# Altium project DM1097_R1M1E1.PrjPcb (part 1 of 12)
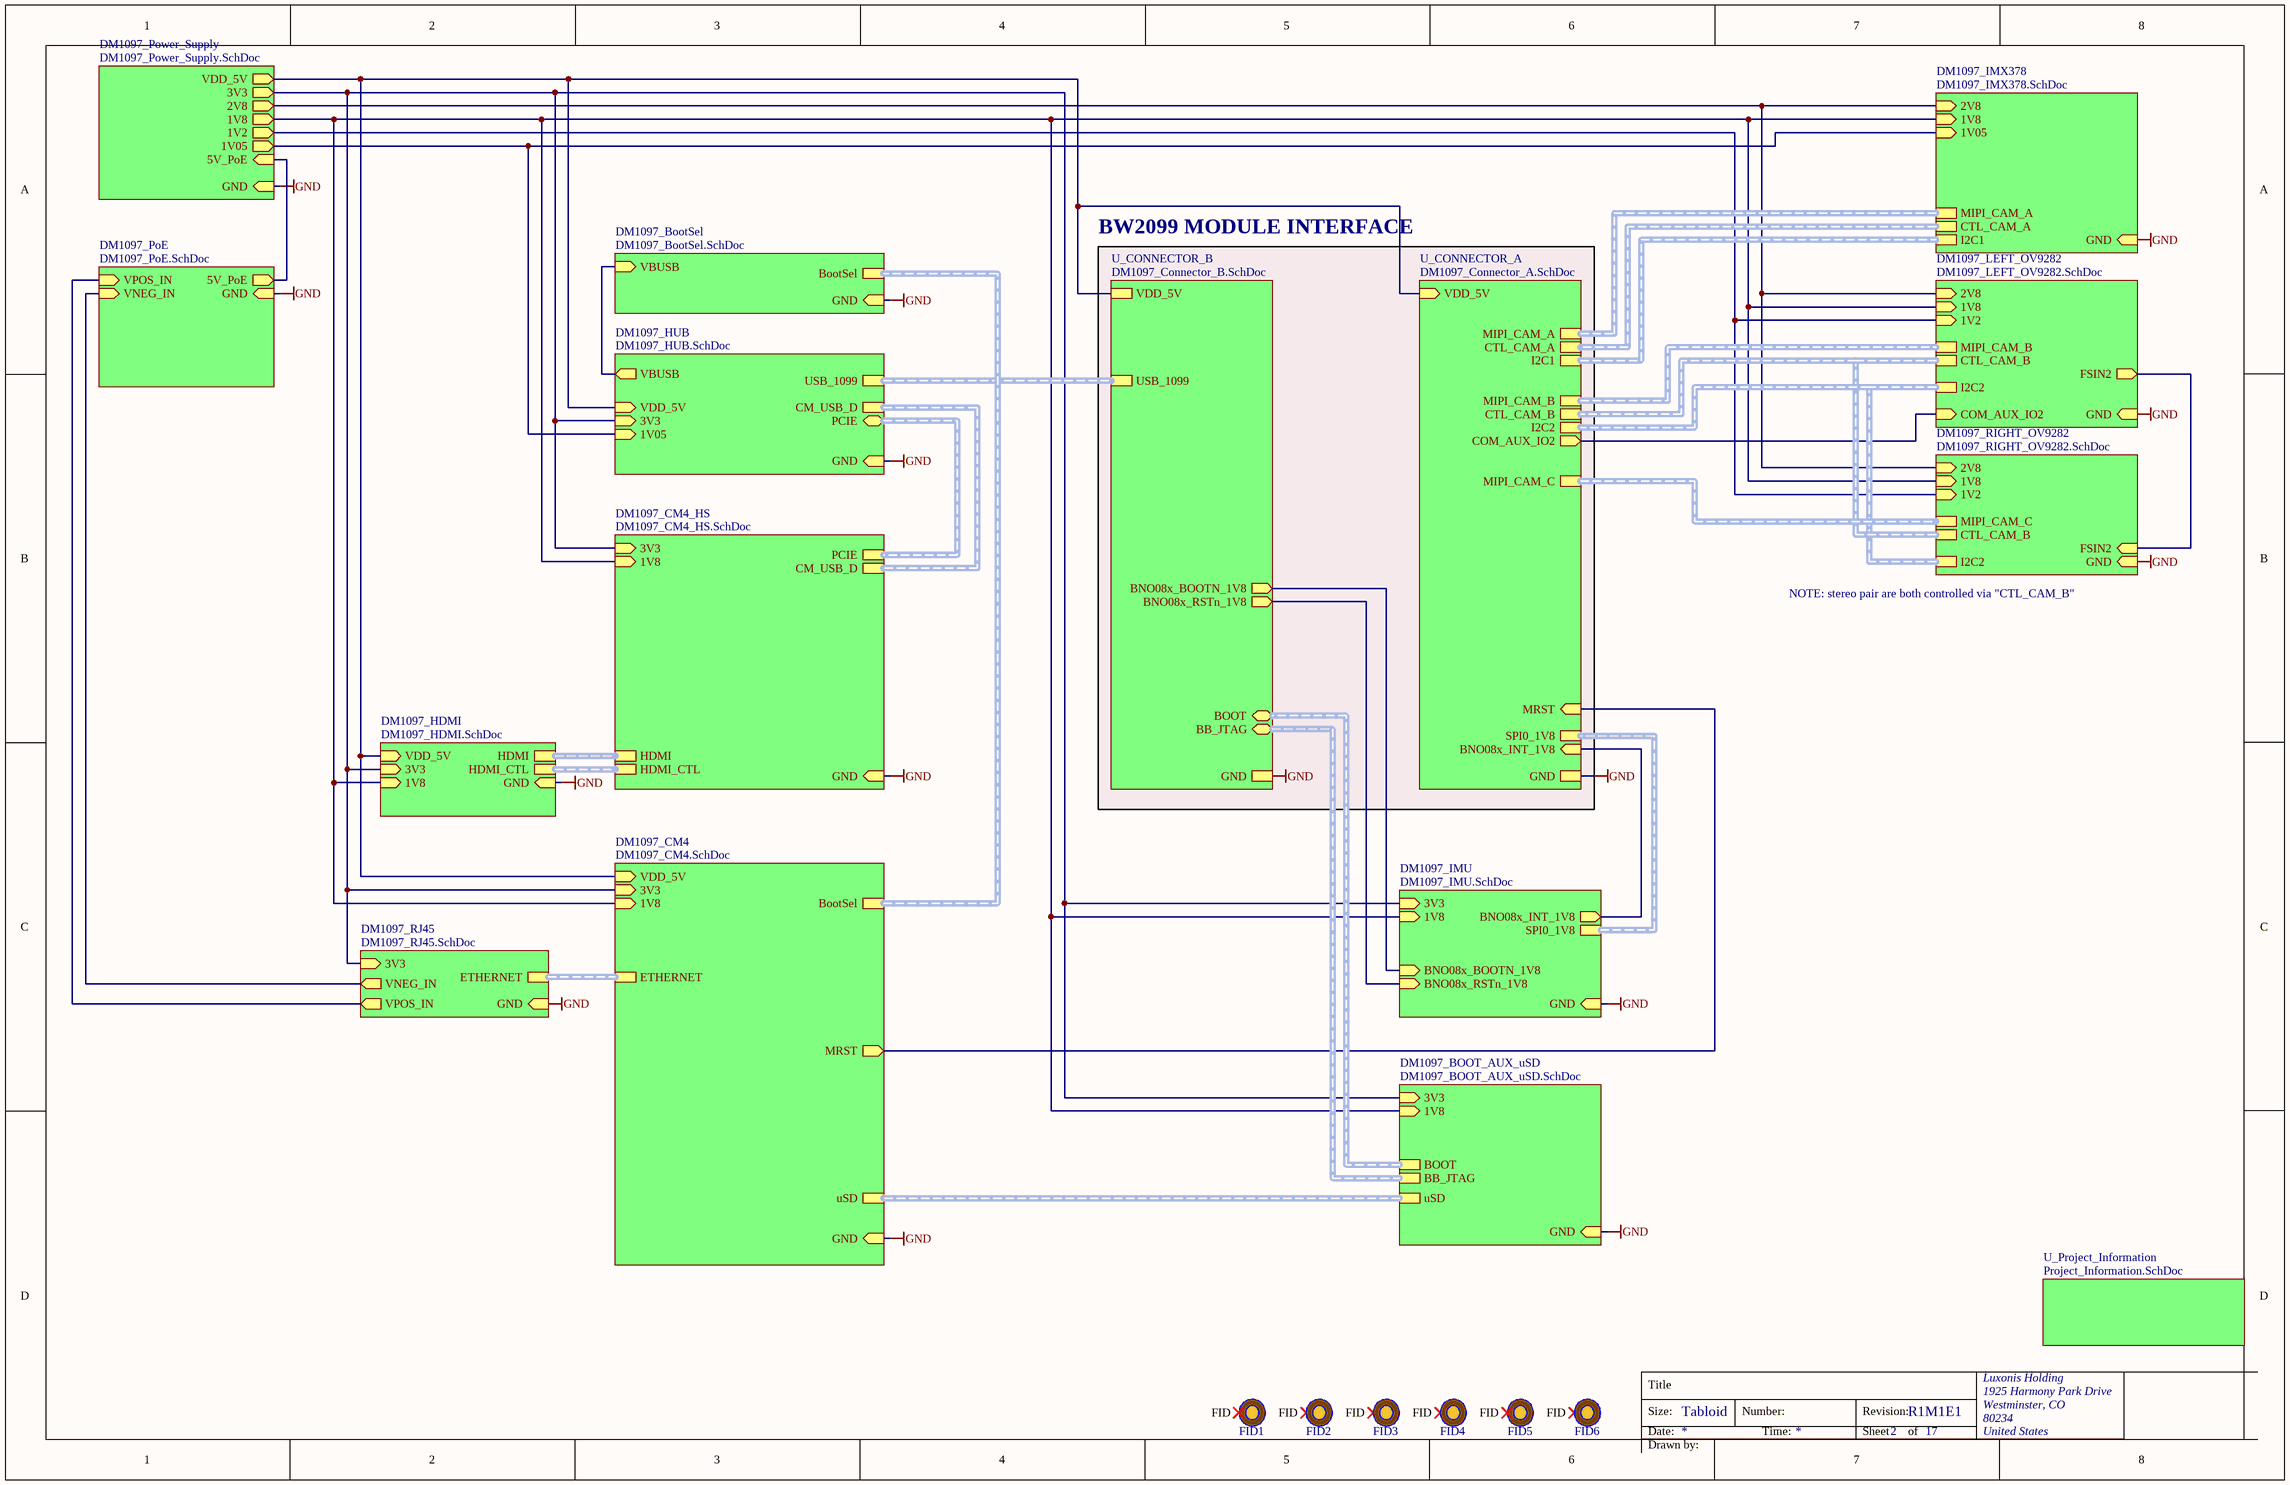
[diagram p0: DM1097_TopLevel.SchDoc]
document_number: D0000200; drawn_by: David Malovrh; project_title: DM1097; revision: R1M1E1
17 sheets, 379 parts. Net scope: strictly hierarchical (ports join the sheet entries above them; power ports are local).
Board file: DM1097_R1M1E1.PcbDoc
Sheets:
  DM1097_TopLevel.SchDoc
    DM1097_IMX378 = DM1097_IMX378.SchDoc
    DM1097_CM4 = DM1097_CM4.SchDoc
    DM1097_BOOT_AUX_uSD = DM1097_BOOT_AUX_uSD.SchDoc
    DM1097_BootSel = DM1097_BootSel.SchDoc
    DM1097_HUB = DM1097_HUB.SchDoc
    DM1097_RJ45 = DM1097_RJ45.SchDoc
    DM1097_RIGHT_OV9282 = DM1097_RIGHT_OV9282.SchDoc
    DM1097_LEFT_OV9282 = DM1097_LEFT_OV9282.SchDoc
    DM1097_Power_Supply = DM1097_Power_Supply.SchDoc
    DM1097_HDMI = DM1097_HDMI.SchDoc
    U_Project_Information = Project_Information.SchDoc
    DM1097_CM4_HS = DM1097_CM4_HS.SchDoc
    DM1097_PoE = DM1097_PoE.SchDoc
    U_CONNECTOR_B = DM1097_Connector_B.SchDoc
    U_CONNECTOR_A = DM1097_Connector_A.SchDoc
    DM1097_IMU = DM1097_IMU.SchDoc

## Sheet DM1097_TopLevel.SchDoc: =project_title
size Tabloid; PageSetup: Record=PageOptions|CenterHorizontal=True|CenterVertical=True|PrintScale=0.73|XCorrection=1.00|YCorrection=1.00|PrintKind=0|BorderSize=5000000|LeftOffset=0|BottomOffset=0|Orientation=2|PaperLength=1000|PaperWidth=1000|Scale=100|PaperSource=7|PrintQuality=-4|MediaType=1|DitherType=10|PaperKind=A4|PrintScaleMode=1; CompanyName: Luxonis Holding; DrawnBy: David Malovrh; Organization: Luxonis Holding; Address1: 1925 Harmony Park Drive; Address2: Westminster, CO; Address3: 80234; Address4: United States; DocumentNumber: D0000200; Revision: R1M1E1; SheetNumber: 2; SheetTotal: 17

### Parts
FID1  FIDUCIAL_ROUND_1MM  [FIDUCIAL_ROUND_1MM]  (value not drawn)  (no BOM)
FID2  FIDUCIAL_ROUND_1MM  [FIDUCIAL_ROUND_1MM]  (value not drawn)  (no BOM)
FID3  FIDUCIAL_ROUND_1MM  [FIDUCIAL_ROUND_1MM]  (value not drawn)  (no BOM)
FID4  FIDUCIAL_ROUND_1MM  [FIDUCIAL_ROUND_1MM]  (value not drawn)  (no BOM)
FID5  FIDUCIAL_ROUND_1MM  [FIDUCIAL_ROUND_1MM]  (value not drawn)  (no BOM)
FID6  FIDUCIAL_ROUND_1MM  [FIDUCIAL_ROUND_1MM]  (value not drawn)  (no BOM)

### Sub-sheets
DM1097_BOOT_AUX_uSD = DM1097_BOOT_AUX_uSD.SchDoc: uSD (harness uSD), 3V3 (in), GND (in), BB_JTAG (harness uSD), BOOT (harness uSD), 1V8 (in)
DM1097_BootSel = DM1097_BootSel.SchDoc: VBUSB (in), BootSel (harness BootSel), GND (in)
DM1097_CM4 = DM1097_CM4.SchDoc: GND (in), 3V3 (in), VDD_5V (in), BootSel (harness BootSel), ETHERNET (harness ETHERNET), 1V8 (in), MRST (out), uSD
DM1097_CM4_HS = DM1097_CM4_HS.SchDoc: HDMI (harness HDMI), HDMI_CTL (harness HDMI_CTL), GND (in), CM_USB_D, PCIE (harness PCIE), 3V3 (in), 1V8 (in)
DM1097_HDMI = DM1097_HDMI.SchDoc: HDMI_CTL (harness HDMI_CTL), HDMI (harness HDMI), 3V3 (in), GND (in), VDD_5V (in), 1V8 (in)
DM1097_HUB = DM1097_HUB.SchDoc: CM_USB_D (harness CM _USB_D), USB_1099 (harness USB_M), VDD_5V (in), 3V3 (in), GND (in), VBUSB (out), PCIE (bidir, harness Harness), 1V05 (in)
DM1097_IMU = DM1097_IMU.SchDoc: 3V3 (in), GND (in), SPI0_1V8 (harness uSD), BNO08x_INT_1V8 (out), BNO08x_BOOTN_1V8 (in), BNO08x_RSTn_1V8 (in), 1V8 (in)
DM1097_IMX378 = DM1097_IMX378.SchDoc: 2V8 (in), 1V05 (in), I2C1 (harness I2C1), MIPI_CAM_A (harness MIPI_CAM_A), CTL_CAM_A (harness CTL_CAM_A), GND (in), 1V8 (in)
DM1097_LEFT_OV9282 = DM1097_LEFT_OV9282.SchDoc: I2C2 (harness I2C2), CTL_CAM_B (harness CTL_CAM_B), MIPI_CAM_B (harness MIPI_CAM_B), 1V2 (in), 2V8 (in), GND (in), 1V8 (in), FSIN2 (out), COM_AUX_IO2 (in)
DM1097_PoE = DM1097_PoE.SchDoc: VNEG_IN (in), VPOS_IN (in), 5V_PoE (out), GND (in)
DM1097_Power_Supply = DM1097_Power_Supply.SchDoc: 1V8 (out), 2V8 (out), 1V05 (out), VDD_5V (out), GND (in), 3V3 (out), 1V2 (out), 5V_PoE (in)
DM1097_RIGHT_OV9282 = DM1097_RIGHT_OV9282.SchDoc: I2C2 (harness I2C2), 1V2 (in), 2V8 (in), GND (in), 1V8 (in), FSIN2 (in), MIPI_CAM_C (harness MIPI_CAM_C), CTL_CAM_B (harness CTL_CAM_B)
DM1097_RJ45 = DM1097_RJ45.SchDoc: 3V3 (in), ETHERNET (harness ETHERNET), GND (in), VNEG_IN (out), VPOS_IN (out)
U_CONNECTOR_A = DM1097_Connector_A.SchDoc: I2C2 (harness I2C2), I2C1 (harness I2C1), MIPI_CAM_C (harness MIPI_CAM_C), CTL_CAM_A (harness CTL_CAM_A), MIPI_CAM_A (harness MIPI_CAM_A), MIPI_CAM_B (harness MIPI_CAM_B), GND, CTL_CAM_B (harness CTL_CAM_B), COM_AUX_IO2 (out), MRST (in), BNO08x_INT_1V8 (in), SPI0_1V8, VDD_5V (in)
U_CONNECTOR_B = DM1097_Connector_B.SchDoc: VDD_5V, GND, BOOT (bidir, harness BOOT), BB_JTAG (bidir, harness BB_JTAG), USB_1099, BNO08x_BOOTN_1V8 (out), BNO08x_RSTn_1V8 (out)
U_Project_Information = Project_Information.SchDoc: no entries

### Nets
1V2: sheet DM1097_RIGHT_OV9282/1V2, sheet DM1097_LEFT_OV9282/1V2, sheet DM1097_Power_Supply/1V2
1V05: sheet DM1097_IMX378/1V05, sheet DM1097_HUB/1V05, sheet DM1097_Power_Supply/1V05
1V8: sheet DM1097_IMX378/1V8, sheet DM1097_CM4/1V8, sheet DM1097_BOOT_AUX_uSD/1V8, sheet DM1097_RIGHT_OV9282/1V8, sheet DM1097_LEFT_OV9282/1V8, sheet DM1097_Power_Supply/1V8, sheet DM1097_HDMI/1V8, sheet DM1097_CM4_HS/1V8, sheet DM1097_IMU/1V8
2V8: sheet DM1097_IMX378/2V8, sheet DM1097_RIGHT_OV9282/2V8, sheet DM1097_LEFT_OV9282/2V8, sheet DM1097_Power_Supply/2V8
3V3: sheet DM1097_CM4/3V3, sheet DM1097_BOOT_AUX_uSD/3V3, sheet DM1097_HUB/3V3, sheet DM1097_RJ45/3V3, sheet DM1097_Power_Supply/3V3, sheet DM1097_HDMI/3V3, sheet DM1097_CM4_HS/3V3, sheet DM1097_IMU/3V3
5V_PoE: sheet DM1097_Power_Supply/5V_PoE, sheet DM1097_PoE/5V_PoE
GND: sheet DM1097_IMX378/GND, sheet DM1097_CM4/GND, sheet DM1097_BOOT_AUX_uSD/GND, sheet DM1097_BootSel/GND, sheet DM1097_HUB/GND, sheet DM1097_RJ45/GND, sheet DM1097_RIGHT_OV9282/GND, sheet DM1097_LEFT_OV9282/GND, sheet DM1097_Power_Supply/GND, sheet DM1097_HDMI/GND, sheet DM1097_CM4_HS/GND, sheet DM1097_PoE/GND, sheet U_CONNECTOR_B/GND, sheet U_CONNECTOR_A/GND, sheet DM1097_IMU/GND
VBUSB: sheet DM1097_BootSel/VBUSB, sheet DM1097_HUB/VBUSB
VDD_5V: sheet DM1097_CM4/VDD_5V, sheet DM1097_HUB/VDD_5V, sheet DM1097_Power_Supply/VDD_5V, sheet DM1097_HDMI/VDD_5V, sheet U_CONNECTOR_B/VDD_5V, sheet U_CONNECTOR_A/VDD_5V
VNEG_IN: sheet DM1097_RJ45/VNEG_IN, sheet DM1097_PoE/VNEG_IN
AUX_IO_IRQ: sheet U_CONNECTOR_A/BNO08x_INT_1V8, sheet DM1097_IMU/BNO08x_INT_1V8
BNO08x_RSTn_1V8: sheet U_CONNECTOR_B/BNO08x_RSTn_1V8, sheet DM1097_IMU/BNO08x_RSTn_1V8
COM_AUX_IO2: sheet DM1097_LEFT_OV9282/COM_AUX_IO2, sheet U_CONNECTOR_A/COM_AUX_IO2
FSIN2: sheet DM1097_RIGHT_OV9282/FSIN2, sheet DM1097_LEFT_OV9282/FSIN2
GPIO1/MRST: sheet DM1097_CM4/MRST, sheet U_CONNECTOR_A/MRST
VPOS_IN: sheet DM1097_RJ45/VPOS_IN, sheet DM1097_PoE/VPOS_IN
NetJ21_42: sheet U_CONNECTOR_B/BNO08x_BOOTN_1V8, sheet DM1097_IMU/BNO08x_BOOTN_1V8

Not connected (* = marked no-connect by the designer): FID1 FID*; FID2 FID*; FID3 FID*; FID4 FID*; FID5 FID*; FID6 FID*

### Buses and harness runs
harness sheet DM1097_BOOT_AUX_uSD/BB_JTAG = sheet U_CONNECTOR_B/BB_JTAG
harness sheet DM1097_BOOT_AUX_uSD/BOOT = sheet U_CONNECTOR_B/BOOT
harness sheet DM1097_BOOT_AUX_uSD/uSD = sheet DM1097_CM4/uSD
harness sheet DM1097_BootSel/BootSel = sheet DM1097_CM4/BootSel
harness sheet DM1097_CM4/ETHERNET = sheet DM1097_RJ45/ETHERNET
harness sheet DM1097_CM4_HS/CM_USB_D = sheet DM1097_HUB/CM_USB_D
harness sheet DM1097_CM4_HS/HDMI = sheet DM1097_HDMI/HDMI
harness sheet DM1097_CM4_HS/HDMI_CTL = sheet DM1097_HDMI/HDMI_CTL
harness sheet DM1097_CM4_HS/PCIE = sheet DM1097_HUB/PCIE
harness sheet DM1097_HUB/USB_1099 = sheet U_CONNECTOR_B/USB_1099
harness sheet DM1097_IMU/SPI0_1V8 = sheet U_CONNECTOR_A/SPI0_1V8
harness sheet DM1097_IMX378/CTL_CAM_A = sheet U_CONNECTOR_A/CTL_CAM_A
harness sheet DM1097_IMX378/I2C1 = sheet U_CONNECTOR_A/I2C1
harness sheet DM1097_IMX378/MIPI_CAM_A = sheet U_CONNECTOR_A/MIPI_CAM_A
harness sheet DM1097_LEFT_OV9282/CTL_CAM_B = sheet DM1097_RIGHT_OV9282/CTL_CAM_B = sheet U_CONNECTOR_A/CTL_CAM_B
harness sheet DM1097_LEFT_OV9282/I2C2 = sheet DM1097_RIGHT_OV9282/I2C2 = sheet U_CONNECTOR_A/I2C2
harness sheet DM1097_LEFT_OV9282/MIPI_CAM_B = sheet U_CONNECTOR_A/MIPI_CAM_B
harness sheet DM1097_RIGHT_OV9282/MIPI_CAM_C = sheet U_CONNECTOR_A/MIPI_CAM_C

### Notes on the sheet
- BW2099 MODULE INTERFACE
- NOTE: stereo pair are both controlled via "CTL_CAM_B"
- Title
- Size:
- Date:
- Tabloid
- Number:
- Time:
- Revision:
- Sheet
- of
- Drawn by:

### Library data of the parts
FID1-FID6 = FIDUCIAL: Fiducial with various available footprints

## Sheet DM1097_IMX378.SchDoc: =project_title
size Tabloid; PageSetup: Record=PageOptions|CenterHorizontal=True|CenterVertical=True|PrintScale=0.71|XCorrection=1.00|YCorrection=1.00|PrintKind=0|BorderSize=5000000|LeftOffset=0|BottomOffset=0|Orientation=2|PaperLength=1000|PaperWidth=1000|Scale=100|PaperSource=7|PrintQuality=-4|MediaType=1|DitherType=10|PrintScaleMode=1|PaperKind=A4; CompanyName: Luxonis Holding; DrawnBy: David Malovrh; Organization: Luxonis Holding; Address1: 1925 Harmony Park Drive; Address2: Westminster, CO; Address3: 80234; Address4: United States; DocumentNumber: D0000200; Revision: R1M1E1; SheetNumber: 4; SheetTotal: 17
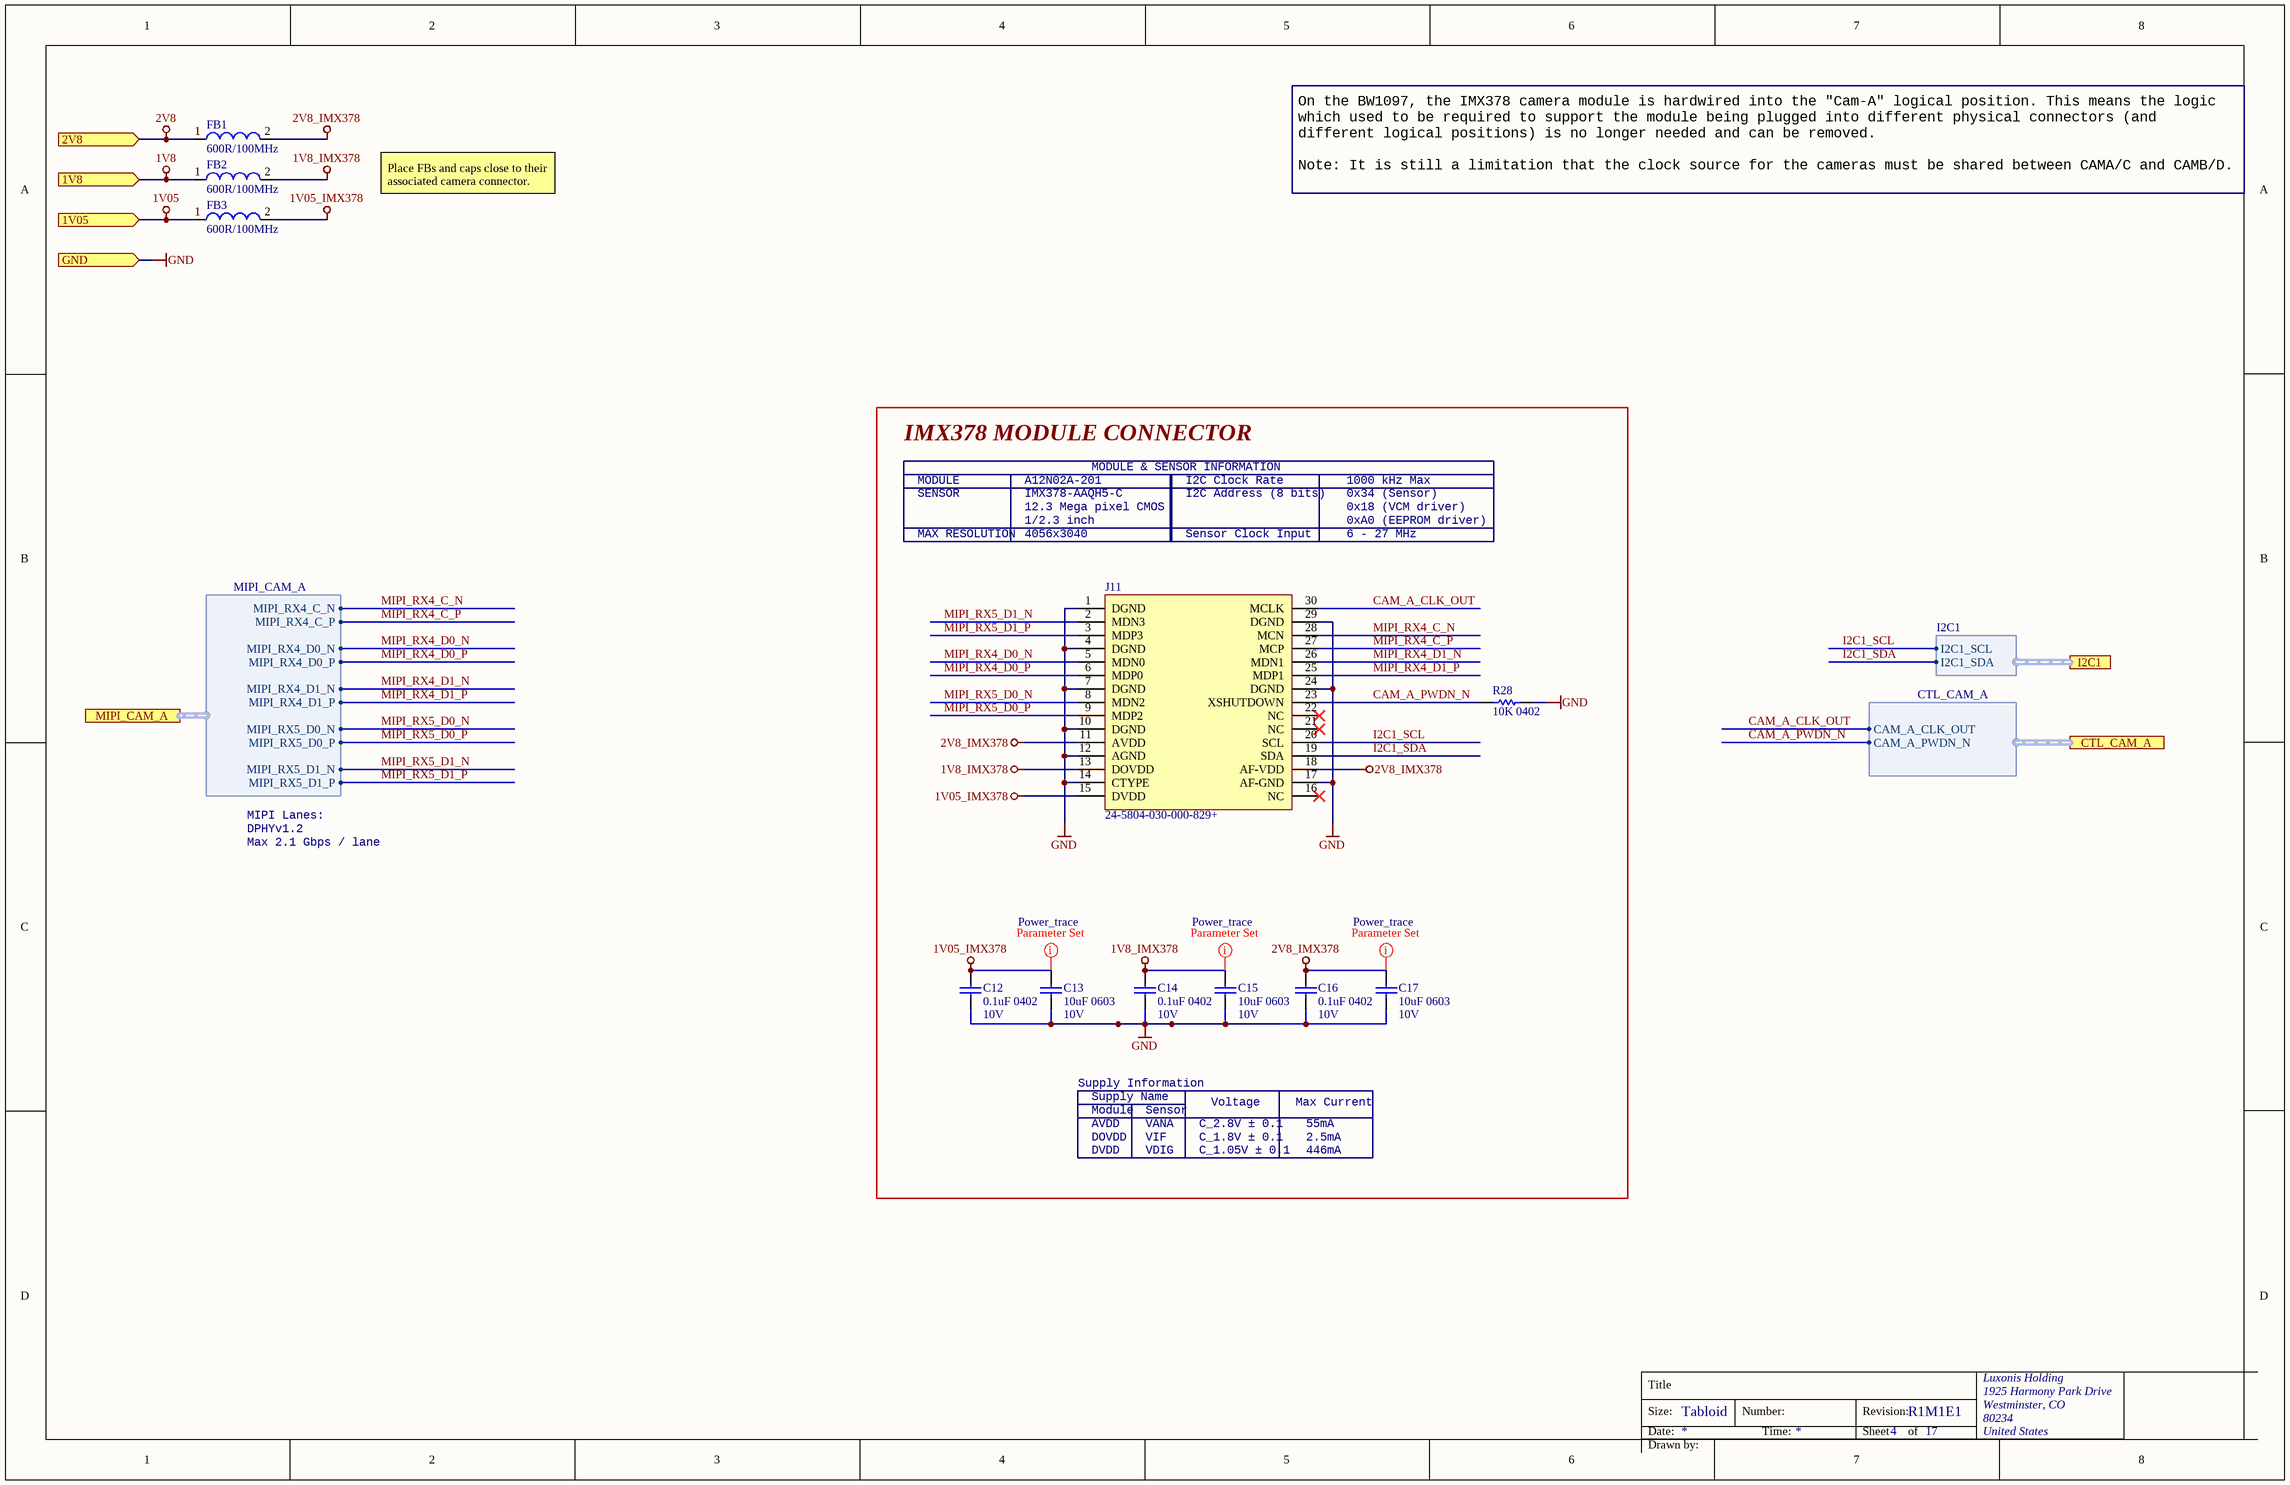
[diagram p1: DM1097_IMX378.SchDoc]

### Parts
C12  0.1uF 0402  Voltage Rating: 10V  [CAPC0402(1005)70_N]
C13  10uF 0603  Voltage Rating: 10V  [CAPC0603(1608)100_N]
C14  0.1uF 0402  Voltage Rating: 10V  [CAPC0402(1005)70_N]
C15  10uF 0603  Voltage Rating: 10V  [CAPC0603(1608)100_N]
C16  0.1uF 0402  Voltage Rating: 10V  [CAPC0402(1005)70_N]
C17  10uF 0603  Voltage Rating: 10V  [CAPC0603(1608)100_N]
FB1  600R/100MHz  [2508056017Y2]
FB2  600R/100MHz  [2508056017Y2]
FB3  600R/100MHz  [2508056017Y2]
J11  24-5804-030-000-829+  [A12N02A-201_1.6mmbrd_MatedModule]
R28  10K 0402  [RESC0402(1005)_N]

### Blocks framed on the sheet
IMX378 MODULE CONNECTOR: C12-C17 J11 R28

### Ports
1V05 (in), 1V8 (in), 2V8 (in), CTL_CAM_A (harness CTL_CAM_A), GND (in), I2C1 (harness I2C1), MIPI_CAM_A (harness MIPI_CAM_A)

### Harnesses
I2C1: I2C1_SDA, I2C1_SCL
MIPI_CAM_A: MIPI_RX4_C_P, MIPI_RX4_C_N, MIPI_RX4_D0_P, MIPI_RX4_D0_N, MIPI_RX4_D1_P, MIPI_RX4_D1_N, MIPI_RX5_D0_P, MIPI_RX5_D0_N, MIPI_RX5_D1_P, MIPI_RX5_D1_N
CTL_CAM_A: CAM_A_PWDN_N, CAM_A_CLK_OUT

### Nets
1V05: FB3.1 ; port 1V05
1V05_IMX378: C12.2 C13.2 FB3.2 J11.15(DVDD)
1V8: FB2.1 ; port 1V8
1V8_IMX378: C14.2 C15.2 FB2.2 J11.13(DOVDD)
2V8: FB1.1 ; port 2V8
2V8_IMX378: C16.2 C17.2 FB1.2 J11.11(AVDD) J11.18(AF-VDD)
GND: C12.1 C13.1 C14.1 C15.1 C16.1 C17.1 J11.1(DGND) J11.4(DGND) J11.7(DGND) J11.10(DGND) J11.12(AGND) J11.14(CTYPE) J11.17(AF-GND) J11.24(DGND) J11.29(DGND) R28.2 ; port GND
CAM_A_CLK_OUT: J11.30(MCLK) ; port CTL_CAM_A.CAM_A_CLK_OUT
CAM_A_PWDN_N: J11.23(XSHUTDOWN) R28.1 ; port CTL_CAM_A.CAM_A_PWDN_N
I2C1_SCL: J11.20(SCL) ; port I2C1.I2C1_SCL
I2C1_SDA: J11.19(SDA) ; port I2C1.I2C1_SDA
MIPI_RX4_C_N: J11.28(MCN) ; port MIPI_CAM_A.MIPI_RX4_C_N
MIPI_RX4_C_P: J11.27(MCP) ; port MIPI_CAM_A.MIPI_RX4_C_P
MIPI_RX4_D0_N: J11.5(MDN0) ; port MIPI_CAM_A.MIPI_RX4_D0_N
MIPI_RX4_D0_P: J11.6(MDP0) ; port MIPI_CAM_A.MIPI_RX4_D0_P
MIPI_RX4_D1_N: J11.26(MDN1) ; port MIPI_CAM_A.MIPI_RX4_D1_N
MIPI_RX4_D1_P: J11.25(MDP1) ; port MIPI_CAM_A.MIPI_RX4_D1_P
MIPI_RX5_D0_N: J11.8(MDN2) ; port MIPI_CAM_A.MIPI_RX5_D0_N
MIPI_RX5_D0_P: J11.9(MDP2) ; port MIPI_CAM_A.MIPI_RX5_D0_P
MIPI_RX5_D1_N: J11.2(MDN3) ; port MIPI_CAM_A.MIPI_RX5_D1_N
MIPI_RX5_D1_P: J11.3(MDP3) ; port MIPI_CAM_A.MIPI_RX5_D1_P

Not connected (* = marked no-connect by the designer): J11 16(NC)* 21(NC)* 22(NC)*

### Layout directives
net class Power_trace: 1V05_IMX378, 1V8_IMX378, 2V8_IMX378

### Notes on the sheet
- Place FBs and caps close to their associated camera connector.
- On the BW1097, the IMX378 camera module is hardwired into the "Cam-A" logical position. This means the logic which used to be required to support the module being plugged into different physical connectors (and different logical positions) is no longer needed and can be removed.
  Note: It is still a limitation that the clock source for the cameras must be shared between CAMA/C and CAMB/D.
- SENSOR
- MODULE
- IMX378-AAQH5-C
- A12N02A-201
- MODULE & SENSOR INFORMATION
- I2C Address (8 bits)
- I2C Clock Rate
- 0x34 (Sensor)
- 1000 kHz Max
- MAX RESOLUTION
- 12.3 Mega pixel CMOS
- 4056x3040
- 1/2.3 inch
- Sensor Clock Input
- 0x18 (VCM driver)
- 0xA0 (EEPROM driver)
- 6 - 27 MHz
- MIPI Lanes:
- DPHYv1.2
- Max 2.1 Gbps / lane
- Supply Information
- Supply Name
- Voltage
- Max Current
- AVDD
- DOVDD
- DVDD
- Module
- VANA
- VIF
- VDIG
- Sensor
- C_2.8V ± 0.1
- C_1.8V ± 0.1
- C_1.05V ± 0.1
- 55mA
- 2.5mA
- 446mA
- Title
- Size:
- Date:
- Tabloid
- Number:
- Time:
- Revision:
- Sheet
- of
- Drawn by:

### Library data of the parts
C12 C14 C16 = GRM155R71A104JA01D: CAP CER 0.1UF 10V X7R 0402 5%; Manufacturer 1: Murata; Capacitance: 100nF; Manufacturer Part Number 1: GRM155R71A104JA01D; Supplier 1: Digi-Key; Stock 1: 1346709; Pricing 1: 1=0.10000, 10=0.02500, 100=0.01130, 500=0.00806, 1000=0.00633, 2500=0.00575, 5000=0.00529 (USD); RoHS: Yes; Mount: Surface Mount; Case/Package: 0402; Case Code (Imperial): 0402; Case Code (Metric): 1005; Min Operating Temperature: -55°C; Max Operating Temperature: 125°C; Tolerance: 5%; Packaging: Tape and Reel; Voltage Rating (DC): 10V; Dielectric: X7R; Package Quantity: 10000; Termination: SMD/SMT; Length: 1mm; Height: 0.5mm; Width: 0.02inch; Thickness: 0.022inch; Depth: 0.5mm; Radiation Hardening: No; Lead Free: Lead Free; ComponentLink1URL: https://datasheet.ciiva.com/5411/product-5411135.pdf?src-supplier=Mouser; ComponentLink1Description: https://datasheet.ciiva.com/5411/product-5411135.pdf?src-supplier=Mouser; ComponentLink2URL: https://datasheet.ciiva.com/11618/c02e-11618821.pdf?src-supplier=Avnet; ComponentLink2Description: https://datasheet.ciiva.com/11618/c02e-11618821.pdf?src-supplier=Avnet; Supplier Part Number 1: 490-10777-1-ND
C13 C15 C17 = GRM188R61A106ME69D: CAP CER 10UF 10V X5R 0603 20%; Manufacturer 1: Murata; Material: Ceramic; Manufacturer Part Number 1: GRM188R61A106ME69D; Supplier 1: Digi-Key; Stock 1: 2873098; Pricing 1: 1=0.21000, 10=0.14100, 100=0.07130, 500=0.04876, 1000=0.04313 (USD); RoHS: Yes; Mount: Surface Mount; Case/Package: 0603; Weight: 0.000222oz; Case Code (Metric): 1608; Case Code (Imperial): 0603; Min Operating Temperature: -55°C; Max Operating Temperature: 85°C; Packaging: Tape and Reel; Tolerance: 20%; Capacitance: 10uF; Dielectric: X5R; Voltage Rating (DC): 10V; Package Quantity: 4000; Termination: SMD/SMT; Length: 1.6mm; Height: 0.8mm; Width: 0.8mm; Thickness: 0.035inch; Depth: 0.8mm; REACH SVHC: Unknown; Lead Free: Lead Free; ComponentLink1URL: http://www.mouser.com/ds/2/281/c02e-2905.pdf?src-supplier=Mouser; ComponentLink1Description: http://www.mouser.com/ds/2/281/c02e-2905.pdf?src-supplier=Mouser; ComponentLink2URL: http://components.arrow.com/part/dataview/0323_06119472?src-supplier=Arrow+Europe; ComponentLink2Description: http://components.arrow.com/part/dataview/0323_06119472?src-supplier=Arrow+Europe; ComponentLink3URL: http://www.farnell.com/datasheets/2048014.pdf?src-supplier=Farnell; ComponentLink3Description: http://www.farnell.com/datasheets/2048014.pdf?src-supplier=Farnell; ComponentLink4URL: http://www.farnell.com/datasheets/1872210.pdf?src-supplier=Farnell; ComponentLink4Description: http://www.farnell.com/datasheets/1872210.pdf?src-supplier=Farnell; ComponentLink5URL: http://search.murata.co.jp/Ceramy/image/img/A01X/G101/ENG/GRM188R61A106ME69-01.pdf?src-supplier=Digi-Key; ComponentLink5Description: http://search.murata.co.jp/Ceramy/image/img/A01X/G101/ENG/GRM188R61A106ME69-01.pdf?src-supplier=Digi-Key; ComponentLink6URL: http://www.farnell.com/datasheets/1872210.pdf?src-supplier=Newark; ComponentLink6Description: http://www.farnell.com/datasheets/1872210.pdf?src-supplier=Newark; ComponentLink7URL: http://www.farnell.com/datasheets/2048014.pdf?src-supplier=Element14; ComponentLink7Description: http://www.farnell.com/datasheets/2048014.pdf?src-supplier=Element14; ComponentLink8URL: http://www.farnell.com/datasheets/2048014.pdf?src-supplier=Newark; ComponentLink8Description: http://www.farnell.com/datasheets/2048014.pdf?src-supplier=Newark; Supplier Part Number 1: 490-10475-1-ND
FB1-FB3 = 2508056017Y2: FERRITE BEAD, 0.1OHM, 2A, 0805, 600R/100MHz; Manufacturer 1: Fair-Rite; Impedance: 600R; Tolerance: 25%; Resistance: 350mR; DC Resistance (DCR): 100mR; Test Frequency: 100MHz; Manufacturer Part Number 1: 2508056017Y2; Supplier 1: Digi-Key; Stock 1: 100491; Pricing 1: 1=0.10000, 10=0.07900, 25=0.07120, 50=0.05240, 100=0.04520, 250=0.03568, 500=0.03014, 1000=0.02538 (USD); RoHS: Yes; Case/Package: 0805; Number of Pins: 2; Case Code (Metric): 2012; Case Code (Imperial): 0805; Min Operating Temperature: -55°C; Max Operating Temperature: 125°C; Package Quantity: 4000; Packaging: Tape and Reel; Max DC Current: 2A; Termination: SMD/SMT; Military Standard: Not; DC Current: 2A; Current Rating: 2A; Frequency: 100MHz; Length: 2mm; Height: 0.9mm; Width: 1.25mm; Depth: 1.25mm; Radiation Hardening: No; REACH SVHC: No SVHC; ComponentLink1URL: https://datasheet.ciiva.com/3854/3802508056017y2-3854245.pdf?src-supplier=Arrow; ComponentLink1Description: https://datasheet.ciiva.com/3854/3802508056017y2-3854245.pdf?src-supplier=Arrow; ComponentLink2URL: https://datasheet.ciiva.com/22735/652149-22735047.pdf?src-supplier=Element14; ComponentLink2Description: https://datasheet.ciiva.com/22735/652149-22735047.pdf?src-supplier=Element14; ComponentLink3URL: https://datasheet.ciiva.com/1127/26143-1127514.pdf?src-supplier=Farnell; ComponentLink3Description: https://datasheet.ciiva.com/1127/26143-1127514.pdf?src-supplier=Farnell; ComponentLink4URL: https://datasheet.ciiva.com/18090/getdatasheetpartid-212640-18090187.pdf?src-supplier=Verical; ComponentLink4Description: https://datasheet.ciiva.com/18090/getdatasheetpartid-212640-18090187.pdf?src-supplier=Verical; ComponentLink5URL: https://datasheet.ciiva.com/7620/26143-7620140.pdf?src-supplier=Element14; ComponentLink5Description: https://datasheet.ciiva.com/7620/26143-7620140.pdf?src-supplier=Element14; Supplier Part Number 1: 1934-1487-1-ND
J11 = A12N02A-201_Connector: CONN Series 5804 board to board 0.4mm pitch 30 way connector; Manufacturer 1: Kyocera International Electronic Components; Manufacturer Part Number 1: 245804030000829+; MAN: AVX/KYOCERA; MAN PN: 24-5804-030-000-829+; Supplier 1: Digi-Key; Stock 1: 11469; Pricing 1: 1=1.69000, 10=1.53600, 25=1.44200, 50=1.37940, 100=1.31670, 250=1.19132, 500=1.09726, 1000=0.94050 (USD); RoHS: Yes; ComponentLink1URL: http://global.kyocera.com/prdct/electro/product/pdf/5804.pdf?src-supplier=Digi-Key; ComponentLink1Description: http://global.kyocera.com/prdct/electro/product/pdf/5804.pdf?src-supplier=Digi-Key; Supplier Part Number 1: 478-12013-1-ND
R28 = RC0402FR-1310KL: RES SMD 10K OHM 1% 0402 1/16W Chip Resistor, 0402 [1005 Metric], 10 kohm, RC Series, 50 V, Thick Film, 62.5 mW; Manufacturer 1: Yageo; Resistance: 10kR; Temperature Coefficient: 100ppm/°C; Power Rating: 62.5mW; Voltage Rating: 50V; Manufacturer Part Number 1: RC0402FR-1310KL; ComponentLink1URL: https://datasheet.ciiva.com/16940/pyu-rc0402-51-rohs-l-6-16940293.pdf?src-supplier=Avnet+Europe; ComponentLink1Description: https://datasheet.ciiva.com/16940/pyu-rc0402-51-rohs-l-6-16940293.pdf?src-supplier=Avnet+Europe; ComponentLink2URL: https://datasheet.ciiva.com/28386/pyu-rc0402-51-rohs-l-6-28386855.pdf?src-supplier=Avnet+Europe; ComponentLink2Description: https://datasheet.ciiva.com/28386/pyu-rc0402-51-rohs-l-6-28386855.pdf?src-supplier=Avnet+Europe; ComponentLink3URL: https://datasheet.ciiva.com/16740/pyu-rc0402-51-rohs-l-6-r-16740602.pdf?src-supplier=Future+Electronics; ComponentLink3Description: https://datasheet.ciiva.com/16740/pyu-rc0402-51-rohs-l-6-r-16740602.pdf?src-supplier=Future+Electronics; ComponentLink4URL: https://datasheet.ciiva.com/8891/pyu-rc0402-51-rohs-l-6-8891339.pdf?src-supplier=Avnet; ComponentLink4Description: https://datasheet.ciiva.com/8891/pyu-rc0402-51-rohs-l-6-8891339.pdf?src-supplier=Avnet; ComponentLink5URL: https://datasheet.ciiva.com/5557/pyu-rc0402-51-rohs-l-6-r-5557997.pdf?src-supplier=Mouser; ComponentLink5Description: https://datasheet.ciiva.com/5557/pyu-rc0402-51-rohs-l-6-r-5557997.pdf?src-supplier=Mouser; ComponentLink6URL: https://datasheet.ciiva.com/7983/1018594-7983533.pdf?src-supplier=Element14; ComponentLink6Description: https://datasheet.ciiva.com/7983/1018594-7983533.pdf?src-supplier=Element14; Supplier 1: Newark; Stock 1: 62239; Pricing 1: 1=0.10000, 25=0.01200, 100=0.00400, 250=0.00400, 500=0.00300, 1000=0.00300 (USD); RoHS: Yes; Case/Package: 0402; Number of Pins: 2; Contact Plating: Tin,Matte,Lead; Case Code (Imperial): 0402; Case Code (Metric): 1005; Min Operating Temperature: -55°C; Max Operating Temperature: 155°C; Tolerance: 1%; Composition: Thick Film; Packaging: Tape and Reel; Termination: SMD/SMT; Military Standard: Not; Voltage Rating (DC): 50V; Working Voltage: 50V; Number of Terminations: 2; Length: 1mm; Depth: 0.5mm; Radiation Hardening: No; REACH SVHC: No SVHC; Lead Free: Lead Free; Supplier Part Number 1: 67R9960; Supplier 2: Future Electronics; Supplier 3: Mouser; Supplier 4: Element14; Supplier Part Number 2: RC0402FR-1310KL-CUTT; Supplier Part Number 3: 603-RC0402FR-1310KL; Supplier Part Number 4: 1799235